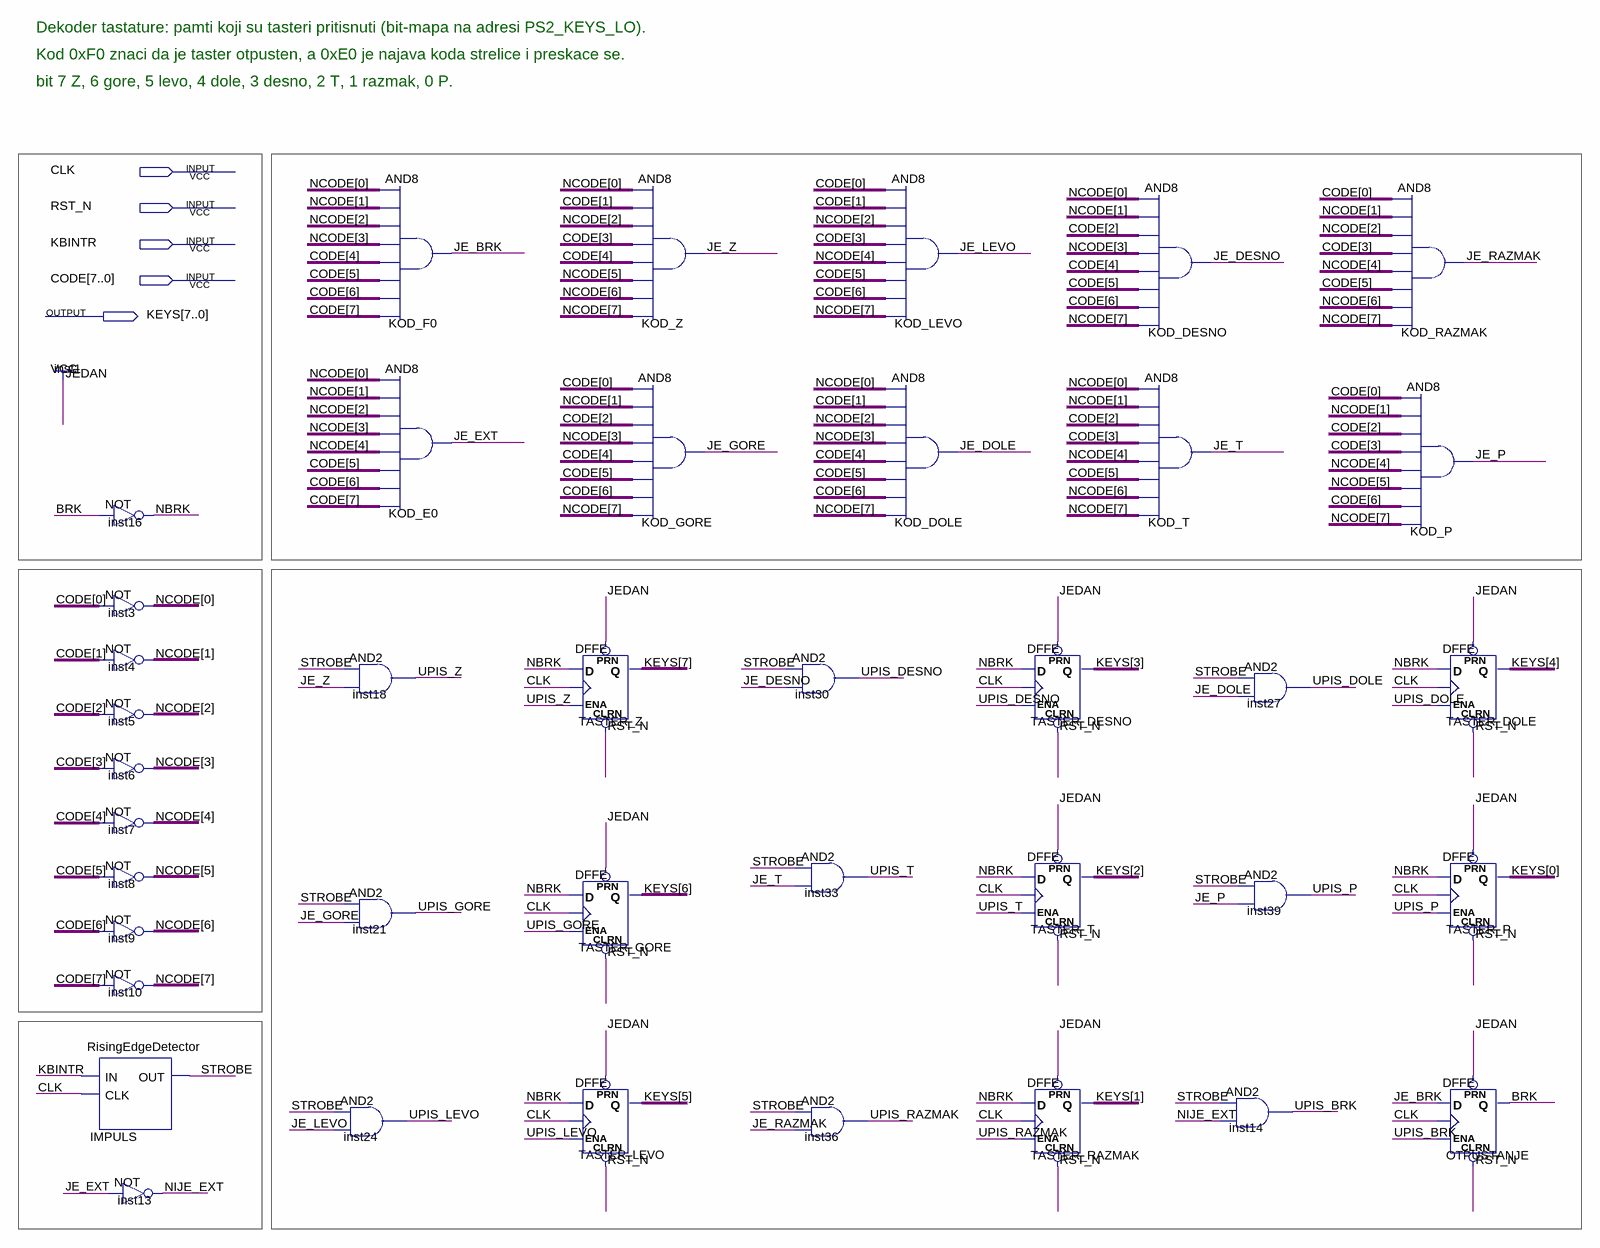
[diagram p0: schematic sheet]
// Quartus schematic kb_keys.bdf as structural Verilog: 39 symbols, 5 pins
module kb_keys (
  input  CLK,
  input  RST_N,
  input  KBINTR,
  input  [7:0] CODE,
  output [7:0] KEYS
);

  wire BRK, JE_BRK, JE_DESNO, JE_DOLE, JE_EXT, JE_GORE, JE_LEVO, JE_P, JE_RAZMAK, JE_T, JE_Z, NBRK, NIJE_EXT,
       STROBE, UPIS_BRK, UPIS_DESNO, UPIS_DOLE, UPIS_GORE, UPIS_LEVO, UPIS_P, UPIS_RAZMAK, UPIS_T, UPIS_Z;
  wire [7:0] NCODE;

  not inst16 (NBRK, BRK);
  not inst3 (NCODE[0], CODE[0]);
  not inst4 (NCODE[1], CODE[1]);
  not inst5 (NCODE[2], CODE[2]);
  not inst6 (NCODE[3], CODE[3]);
  not inst7 (NCODE[4], CODE[4]);
  not inst8 (NCODE[5], CODE[5]);
  not inst9 (NCODE[6], CODE[6]);
  not inst10 (NCODE[7], CODE[7]);
  RisingEdgeDetector IMPULS (.IN(KBINTR), .CLK(CLK), .OUT(STROBE));
  not inst13 (NIJE_EXT, JE_EXT);
  and KOD_F0 (JE_BRK, NCODE[0], NCODE[1], NCODE[2], NCODE[3], CODE[4], CODE[5], CODE[6], CODE[7]);
  and KOD_E0 (JE_EXT, NCODE[0], NCODE[1], NCODE[2], NCODE[3], NCODE[4], CODE[5], CODE[6], CODE[7]);
  and inst18 (UPIS_Z, STROBE, JE_Z);
  and inst21 (UPIS_GORE, STROBE, JE_GORE);
  and inst24 (UPIS_LEVO, STROBE, JE_LEVO);
  DFFE TASTER_Z (.PRN(1'b1), .CLRN(RST_N), .D(NBRK), .CLK(CLK), .ENA(UPIS_Z), .Q(KEYS[7]));
  DFFE TASTER_GORE (.PRN(1'b1), .CLRN(RST_N), .D(NBRK), .CLK(CLK), .ENA(UPIS_GORE), .Q(KEYS[6]));
  DFFE TASTER_LEVO (.PRN(1'b1), .CLRN(RST_N), .D(NBRK), .CLK(CLK), .ENA(UPIS_LEVO), .Q(KEYS[5]));
  and KOD_Z (JE_Z, NCODE[0], CODE[1], NCODE[2], CODE[3], CODE[4], NCODE[5], NCODE[6], NCODE[7]);
  and KOD_GORE (JE_GORE, CODE[0], NCODE[1], CODE[2], NCODE[3], CODE[4], CODE[5], CODE[6], NCODE[7]);
  and inst30 (UPIS_DESNO, STROBE, JE_DESNO);
  and inst33 (UPIS_T, STROBE, JE_T);
  and inst36 (UPIS_RAZMAK, STROBE, JE_RAZMAK);
  and KOD_LEVO (JE_LEVO, CODE[0], CODE[1], NCODE[2], CODE[3], NCODE[4], CODE[5], CODE[6], NCODE[7]);
  and KOD_DOLE (JE_DOLE, NCODE[0], CODE[1], NCODE[2], NCODE[3], CODE[4], CODE[5], CODE[6], NCODE[7]);
  DFFE TASTER_DESNO (.PRN(1'b1), .CLRN(RST_N), .D(NBRK), .CLK(CLK), .ENA(UPIS_DESNO), .Q(KEYS[3]));
  DFFE TASTER_T (.PRN(1'b1), .CLRN(RST_N), .D(NBRK), .CLK(CLK), .ENA(UPIS_T), .Q(KEYS[2]));
  DFFE TASTER_RAZMAK (.PRN(1'b1), .CLRN(RST_N), .D(NBRK), .CLK(CLK), .ENA(UPIS_RAZMAK), .Q(KEYS[1]));
  and KOD_DESNO (JE_DESNO, NCODE[0], NCODE[1], CODE[2], NCODE[3], CODE[4], CODE[5], CODE[6], NCODE[7]);
  and KOD_T (JE_T, NCODE[0], NCODE[1], CODE[2], CODE[3], NCODE[4], CODE[5], NCODE[6], NCODE[7]);
  and inst27 (UPIS_DOLE, STROBE, JE_DOLE);
  and inst39 (UPIS_P, STROBE, JE_P);
  and inst14 (UPIS_BRK, STROBE, NIJE_EXT);
  and KOD_RAZMAK (JE_RAZMAK, CODE[0], NCODE[1], NCODE[2], CODE[3], NCODE[4], CODE[5], NCODE[6], NCODE[7]);
  and KOD_P (JE_P, CODE[0], NCODE[1], CODE[2], CODE[3], NCODE[4], NCODE[5], CODE[6], NCODE[7]);
  DFFE TASTER_DOLE (.PRN(1'b1), .CLRN(RST_N), .D(NBRK), .CLK(CLK), .ENA(UPIS_DOLE), .Q(KEYS[4]));
  DFFE TASTER_P (.PRN(1'b1), .CLRN(RST_N), .D(NBRK), .CLK(CLK), .ENA(UPIS_P), .Q(KEYS[0]));
  DFFE OTPUSTANJE (.PRN(1'b1), .CLRN(RST_N), .D(JE_BRK), .CLK(CLK), .ENA(UPIS_BRK), .Q(BRK));

  // Notes on the sheet:
  //   Dekoder tastature: pamti koji su tasteri pritisnuti (bit-mapa na adresi PS2_KEYS_LO).
  //   Kod 0xF0 znaci da je taster otpusten, a 0xE0 je najava koda strelice i preskace se.
  //   bit 7 Z, 6 gore, 5 levo, 4 dole, 3 desno, 2 T, 1 razmak, 0 P.
endmodule
